# EAGLE schematic esp12display (EAGLE 7.7.0)
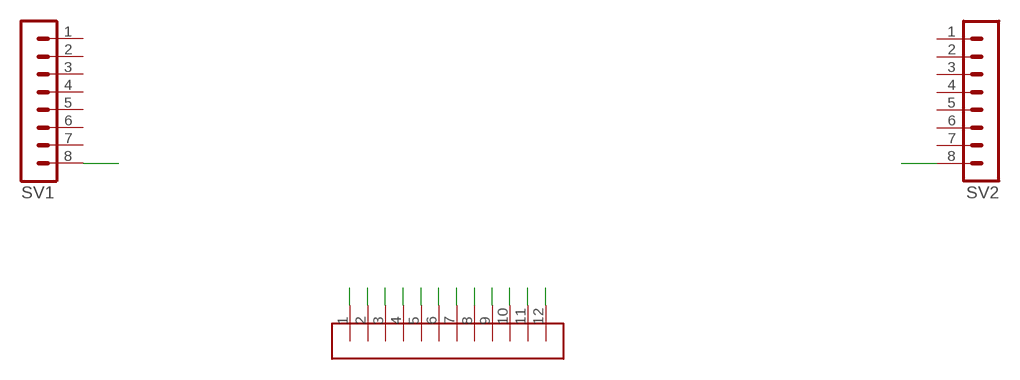
[diagram p0: schematic, sheet 1]

## Parts
SV1  MA08-1  [MA08-1]
SV2  MA08-1  [MA08-1]
U$2  12PIN_LCD_PADS  [PINS_ONLY]

## Nets
GND: SV2.8
N$1: SV1.8
N$2: U$2.1
N$3: U$2.2
N$4: U$2.3
N$5: U$2.4
N$6: U$2.5
N$7: U$2.6
N$8: U$2.7
N$9: U$2.8
N$10: U$2.9
N$11: U$2.10
N$12: U$2.11
N$13: U$2.12
Unconnected: SV1.1 SV1.2 SV1.3 SV1.4 SV1.5 SV1.6 SV1.7 SV2.1 SV2.2 SV2.3 SV2.4 SV2.5 SV2.6 SV2.7

## Library data of the parts
SV1 SV2 = con-lstb:MA08-1: PIN HEADER; OC_FARNELL: unknown; OC_NEWARK: unknown
U$2 = 12Pin_LCD_Connector:12PIN_LCD_PADS